# EAGLE design ChargerShieldExpLCD (EAGLE 6.5.0)
Dings

## Sheet 1 of 3: User Interface
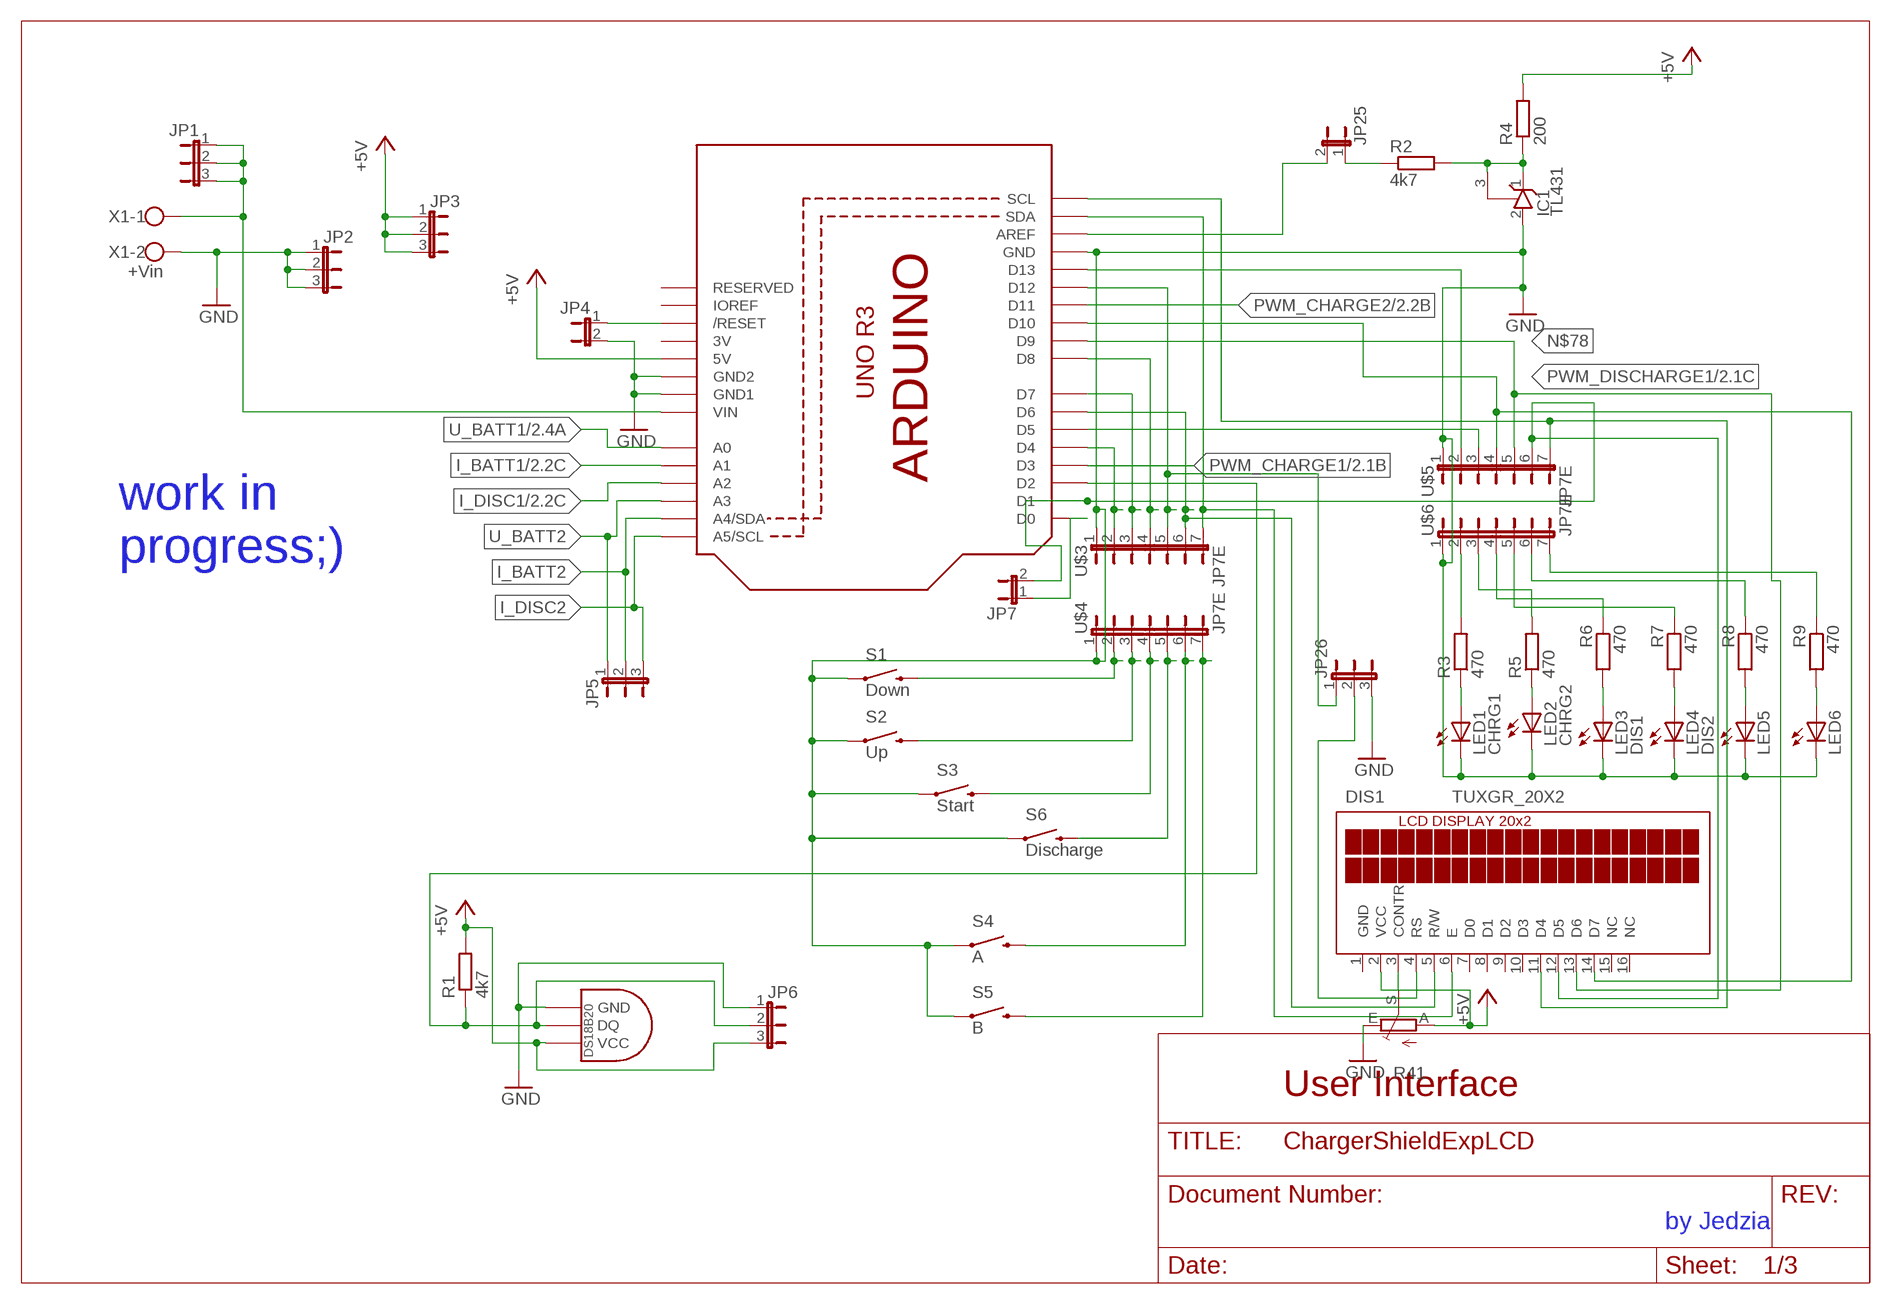
[diagram p0: schematic, sheet 1]

### Parts
DIS1  TUXGR_20X2  [TUXGR_20X2]
IC1  TL431  TL431TO92  [TO92]
JP1  JP2E  [JP2]
JP2  JP2E  [JP2]
JP3  JP2E  [JP2]
JP4  JP1E  [JP1]
JP5  JP2E  [JP2]
JP6  JP2E  [JP2]
JP7  JP1E  [JP1]
JP25  JP1E  [JP1]
JP26  JP2E  [JP2]
LED1  CHRG1  LED5MM_BIG  [LED5MM_BIG]
LED2  CHRG2  LED5MM_BIG  [LED5MM_BIG]
LED3  DIS1  LED5MM_BIG  [LED5MM_BIG]
LED4  DIS2  LED5MM_BIG  [LED5MM_BIG]
LED5  LED5MM_BIG  [LED5MM_BIG]
LED6  LED5MM_BIG  [LED5MM_BIG]
R1  4k7  R-EU_0204/7  [0204/7]
R2  4k7  R-EU_0207/10  [0207/10]
R3  470  R-EU_0207/12  [0207/12]
R4  200  R-EU_0204/7  [0204/7]
R5  470  R-EU_0207/10  [0207/10]
R6  470  R-EU_0207/10  [0207/10]
R7  470  R-EU_0207/10  [0207/10]
R8  470  R-EU_0204/7  [0204/7]
R9  470  R-EU_0204/7  [0204/7]
R41  TRIM_EU-B25P  [B25P]
S1  Down  SWITCH-MOMENTARY-2PTH_UMSE  [TACTILE-PTH-UMSE]
S2  Up  SWITCH-MOMENTARY-2PTH_UMSE  [TACTILE-PTH-UMSE]
S3  Start  SWITCH-MOMENTARY-2PTH_UMSE  [TACTILE-PTH-UMSE]
S4  A  SWITCH-MOMENTARY-2PTH_UMSE  [TACTILE-PTH-UMSE]
S5  B  SWITCH-MOMENTARY-2PTH_UMSE  [TACTILE-PTH-UMSE]
S6  Discharge  SWITCH-MOMENTARY-2PTH_UMSE  [TACTILE-PTH-UMSE]
U$1  DS1820TO92  [DS1820]
U$2  ARDUINOR3BPLACE-LONG  [ARDUINOR3-BPLACE-LONG]
U$3  JP7E  [JP7]
U$4  JP7E  [JP7]
U$5  JP7E  [JP7]
U$6  JP7E  [JP7]
X1  +Vin  W237-102  [W237-102]

### Nets
+5V: DIS1.2(VCC) JP3.1 JP3.2 JP3.3 JP6.3 R1.2 R4.2 R41.A U$1.VDD(VCC) U$2.5V ; also sheet 2,3
GND: IC1.2(A) JP2.1 JP2.2 JP2.3 JP4.2 JP6.1 JP26.3 LED1.K(C) LED2.K(C) LED3.K(C) LED4.K(C) LED5.K(C) LED6.K(C) R41.E S1.1 S2.1 S3.1 S4.1 S5.1 S6.1 U$1.GND U$2.GND U$2.GND1 U$2.GND2 U$3.1 U$4.1 U$5.1 U$6.1 X1.2 ; also sheet 2,3
I_BATT1: U$2.A1 ; also sheet 2
I_BATT2: JP5.2 U$2.A4(A4/SDA)
I_DISC1: U$2.A2 ; also sheet 2
I_DISC2: JP5.3 U$2.A5(A5/SCL)
N$1: U$2.D13 U$5.2
N$2: LED1.A R3.1
N$12: JP6.2 R1.1 U$1.DQ U$2.D2
N$19: R7.1 U$6.5
N$20: LED3.A R6.2
N$21: LED4.A R7.2
N$23: U$2.D5 U$5.3
N$24: LED2.A R5.1
N$26: S1.3 U$4.2
N$27: IC1.1(C) IC1.3(R) R2.2 R4.1
N$28: JP25.2 U$2.AREF
N$30: S2.3 U$4.3
N$31: S3.3 U$4.4
N$37: S4.3 U$4.6
N$38: S5.3 U$4.7
N$39: LED5.A R8.2
N$40: LED6.A R9.2
N$41: R5.2 U$6.3
N$42: R9.1 U$6.7
N$52: JP7.1 U$2.D0
N$53: JP4.1 U$2.RESET(/RESET)
N$57: DIS1.3(CONTR) R41.S
N$63: DIS1.4(RS) JP26.2
N$64: JP25.1 R2.1
N$67: JP26.1 U$2.D12 U$3.5
N$68: R6.1 U$6.4
N$69: DIS1.11(D4) U$2.SCL U$5.7
N$70: R3.2 U$6.2
N$71: DIS1.6(E) U$2.SDA U$3.7
N$73: S6.3 U$4.5
N$74: U$2.D8 U$3.4
N$75: U$2.D7 U$3.3
N$76: U$2.D4 U$3.2
N$77: DIS1.5(R/W) U$2.D6 U$3.6
N$78: DIS1.13(D6) U$2.D9 U$5.5
N$84: R8.1 U$6.6
PWM_CHARGE1: U$2.D3 ; also sheet 2
PWM_CHARGE2: U$2.D11 ; also sheet 2
PWM_DISCHARGE1: DIS1.14(D7) U$2.D10 U$5.4 ; also sheet 2
PWM_DISCHARGE2: DIS1.12(D5) JP7.2 U$2.D1 U$5.6
U_BATT1: U$2.A0 ; also sheet 2
U_BATT2: JP5.1 U$2.A3
VIN: JP1.1 JP1.2 JP1.3 U$2.VIN X1.1 ; also sheet 2
Unconnected: DIS1.7(D0) DIS1.8(D1) DIS1.9(D2) DIS1.10(D3) DIS1.15(NC) DIS1.16(NC) U$2.IOREF U$2.RESERVED

### Notes on the sheet
- work in
  progress;)
- User Interface
- by Jedzia

## Sheet 2 of 3
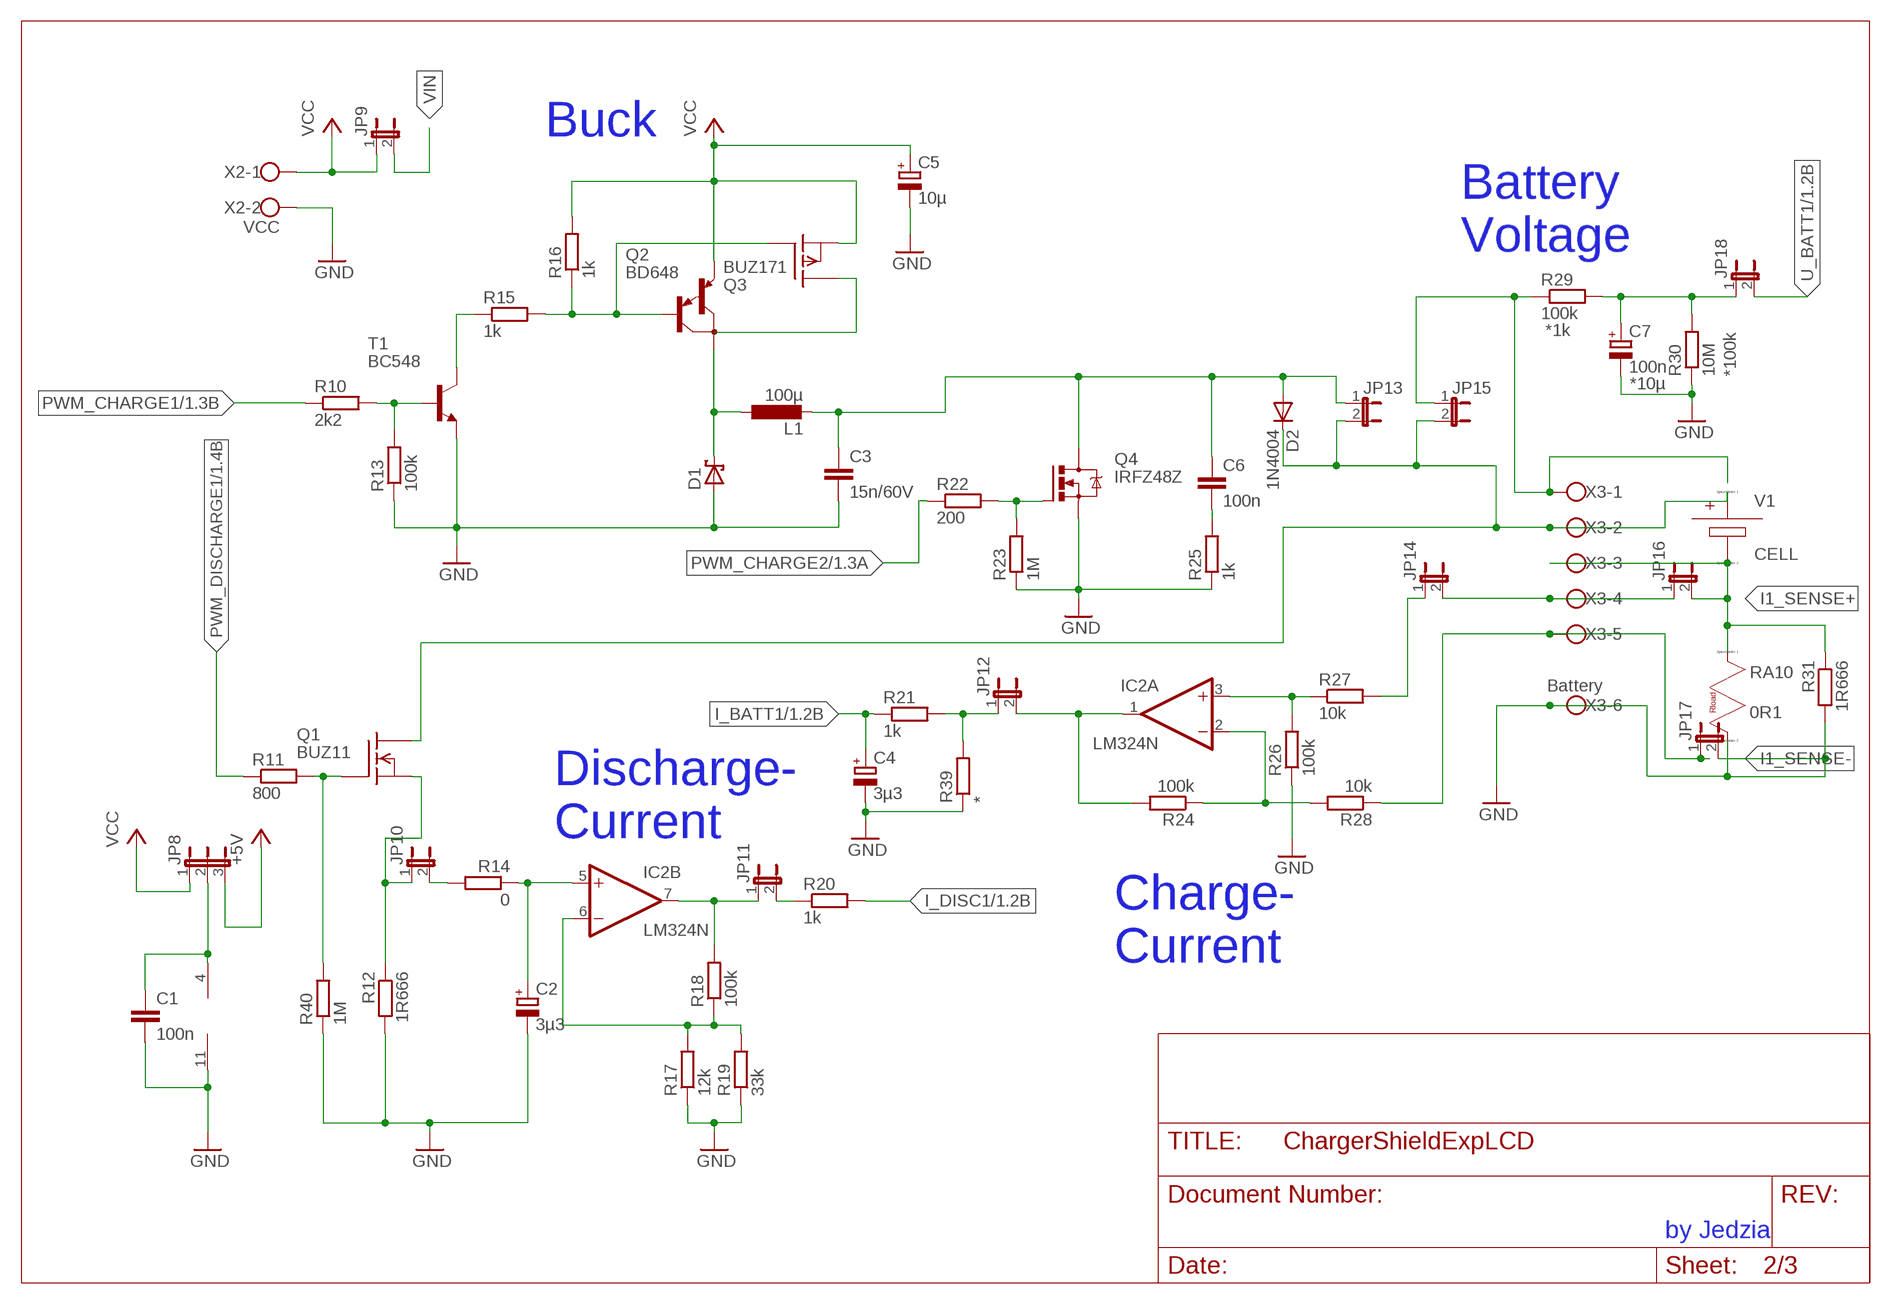
[diagram p1: schematic, sheet 2]

### Parts
C1  100n  C-EU025_050-025X075  [C025_050-025X075]
C2  3µ3  CPOL-EUE5-5  [E5-5]
C3  15n/60V  C-EU025_050-025X075  [C025_050-025X075]
C4  3µ3  CPOL-EUE5-5  [E5-5]
C5  10µ  CPOL-EUE5-5  [E5-5]
C6  100n  C-EU025_050-025X075  [C025_050-025X075]
C7  100n  CPOL-EUE5-5  [E5-5]
D1  SCHOTTKY-DIODEF126Z12  [F126Z12]
D2  1N4004  [DO41-10]
IC2  LM324N  [DIL14]
JP8  JP2E  [JP2]
JP9  JP1E  [JP1]
JP10  JP1E  [JP1]
JP11  JP1E  [JP1]
JP12  JP1E  [JP1]
JP13  JP1E  [JP1]
JP14  JP1E  [JP1]
JP15  JP1E  [JP1]
JP16  JP1E  [JP1]
JP17  JP1E  [JP1]
JP18  JP1E  [JP1]
L1  100µ  L-EU0207/12  [0207/12]
Q1  BUZ11  [TO220]
Q2  BD648  [TO220]
Q3  BUZ171  [TO220]
Q4  IRFZ48Z  [TO220BH]
R10  2k2  R-EU_0207/15  [0207/15]
R11  800  R-EU_0204/7  [0204/7]
R12  1R666  R-EU_0414/15  [0414/15]
R13  100k  R-EU_0207/10  [0207/10]
R14  0  R-EU_0207/10  [0207/10]
R15  1k  R-EU_0207/10  [0207/10]
R16  1k  R-EU_0207/10  [0207/10]
R17  12k  R-EU_0207/10  [0207/10]
R18  100k  R-EU_0207/10  [0207/10]
R19  33k  R-EU_0207/10  [0207/10]
R20  1k  R-EU_0207/15  [0207/15]
R21  1k  R-EU_0204/7  [0204/7]
R22  200  R-EU_0207/12  [0207/12]
R23  1M  R-EU_0207/10  [0207/10]
R24  100k  R-EU_0204/7  [0204/7]
R25  1k  R-EU_0207/10  [0207/10]
R26  100k  R-EU_0204/7  [0204/7]
R27  10k  R-EU_0207/10  [0207/10]
R28  10k  R-EU_0207/10  [0207/10]
R29  100k  R-EU_0207/12  [0207/12]
R30  10M  R-EU_0207/10  [0207/10]
R31  1R666  R-EU_0414/15  [0414/15]
R39  *  R-EU_0204/7  [0204/7]
R40  1M  R-EU_0207/10  [0207/10]
RA10  0R1  RES_RLOAD  (no package)
T1  BC548  BC238  [TO92]
V1  CELL  (no package)
X2  VCC  W237-102  [W237-102]
X3  Battery  W237-6  [W237-6]

### Nets
+5V: JP8.3 ; also sheet 1,3
GND: C1.2 C2.- C3.2 C4.- C5.- C7.- D1.A IC2.11(P:V-) JP17.2 Q4.S R12.2 R13.1 R17.1 R19.1 R23.1 R25.1 R26.1 R30.1 R31.2 R39.1 R40.1 RA10.B T1.1(E) X2.2 X3.6 ; also sheet 1,3
I1_SENSE+: JP16.2 R31.1 RA10.A V1.- X3.3
I1_SENSE-: JP17.1 R28.1 X3.5
I_BATT1: C4.+ R21.1 ; also sheet 1
I_DISC1: R20.2 ; also sheet 1
N$3: C7.+ JP18.1 R29.2 R30.2
N$4: C1.1 IC2.4(P:V+) JP8.2
N$5: R10.2 R13.2 T1.2(B)
N$6: R15.1 T1.3(C)
N$7: Q2.1(B) Q3.1(G) R15.2 R16.1
N$8: JP15.1 R29.1 X3.1
N$9: D1.C L1.1 Q2.2(C)
N$10: C3.1 C6.1 D2.A JP13.1 L1.2 Q4.D
N$11: IC2.1(A:OUT) JP12.2 R24.2
N$13: D2.C JP13.2 JP15.2 Q1.2(D) V1.+ X3.2
N$14: IC2.2(A:-IN) R24.1 R28.2
N$15: IC2.3(A:+IN) R26.2 R27.1
N$16: IC2.6(B:-IN) R17.2 R18.1 R19.2
N$17: IC2.7(B:OUT) JP11.1 R18.2
N$18: Q1.1(G) R11.2 R40.2
N$22: JP14.1 R27.2
N$25: JP10.1 Q1.3(S) R12.1
N$29: C2.+ IC2.5(B:+IN) R14.1
N$32: JP12.1 R21.2 R39.2
N$33: JP10.2 R14.2
N$35: JP11.2 R20.1
N$50: C6.2 R25.2
N$51: Q4.G R22.2 R23.2
N$54: JP14.2 JP16.1 X3.4
N$66: Q3.2(D)
PWM_CHARGE1: R10.1 ; also sheet 1
PWM_CHARGE2: R22.1 ; also sheet 1
PWM_DISCHARGE1: R11.1 ; also sheet 1
U_BATT1: JP18.2 ; also sheet 1
VCC: C5.+ JP8.1 JP9.1 Q2.3(E) Q3.3(S) R16.2 X2.1 ; also sheet 3
VIN: JP9.2 ; also sheet 1

### Notes on the sheet
- Buck
- Battery
  Voltage
- *1k
- *100k
- *10µ
- Discharge-
  Current
- Charge-
  Current
- by Jedzia

## Sheet 3 of 3
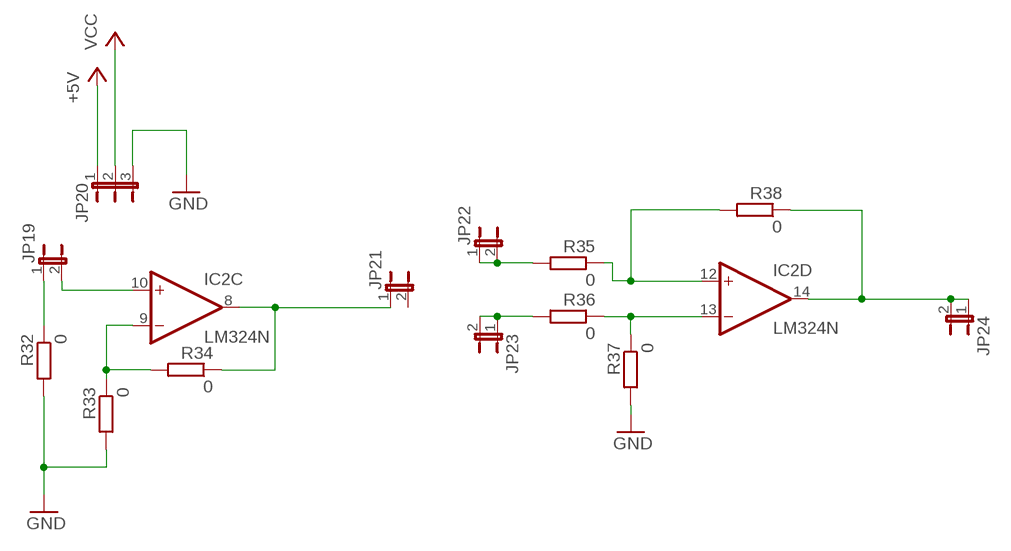
[diagram p2: schematic, sheet 3]

### Parts
JP19  JP1E  [JP1]
JP20  JP2E  [JP2]
JP21  JP1E  [JP1]
JP22  JP1E  [JP1]
JP23  JP1E  [JP1]
JP24  JP1E  [JP1]
R32  0  R-EU_0204/7  [0204/7]
R33  0  R-EU_0204/7  [0204/7]
R34  0  R-EU_0204/2V  [0204V]
R35  0  R-EU_0207/10  [0207/10]
R36  0  R-EU_0204/7  [0204/7]
R37  0  R-EU_0204/7  [0204/7]
R38  0  R-EU_0204/7  [0204/7]

### Nets
+5V: JP20.1 ; also sheet 1,2
GND: JP20.3 R32.2 R33.2 R37.2 ; also sheet 1,2
N$34: IC2.8(C:OUT) JP21.1 R34.1
N$36: IC2.13(D:-IN) R36.1 R37.1
N$43: IC2.10(C:+IN) JP19.2
N$44: JP19.1 R32.1
N$45: IC2.12(D:+IN) R35.1 R38.2
N$46: JP22.1 JP22.2 R35.2
N$47: JP23.1 JP23.2 R36.2
N$48: IC2.14(D:OUT) JP24.1 JP24.2 R38.1
N$49: IC2.9(C:-IN) R33.1 R34.2
VCC: JP20.2 ; also sheet 2
Unconnected: JP21.2

## Power pins joined to a net without a drawn wire
3V: U$2.3V
GND: DIS1.1(GND)

## Library data of the parts
C1 C3 C6 = rcl:C-EU: CAPACITOR, European symbol
C2 C4 C5 C7 = rcl:CPOL-EU: POLARIZED CAPACITOR, European symbol
D1 = diode:SCHOTTKY-DIODE: Schottky Diode
D2 = diode:1N4004: DIODE general purpose rectifier, 1 A
DIS1 = display-lcd:TUXGR_20X2: Tuxgraphics LCD display 20x2 characters reflective, without background light Source: tuxgr_20x2.pdf; OC_FARNELL: unknown; OC_NEWARK: unknown
IC1 = AWJLEagleLib:TL431: TL431 shunt regulator CARE: not a standard pinout. This part has 1: cathode, 2: REF, 3: anode
IC2 = linear:LM324: OP AMP
JP1-JP3 JP5 JP6 JP8 JP20 JP26 = bigger:JP2E: JUMPER
JP4 JP7 JP9-JP19 JP21-JP25 = bigger:JP1E: JUMPER
L1 = rcl:L-EU: INDUCTOR, European symbol
LED1-LED6 = bigger:LED: LED OSRAM: - CHIPLED LG R971, LG N971, LY N971, LG Q971, LY Q971, LO R971, LY R971 LH N974, LH R974 LS Q976, LO Q976, LY Q976 LO Q996 - Hyper CHIPLED LW Q18S LB Q993, LB Q99A, LB R99A - SideLED LS A670, LO A670, LY A670, LG A670, LP A670 LB A673, LV A673, LT A673, LW A673 LH A674 LY A675 LS A676, LA A676, LO A676, LY A676, LW A676 LS A679, LY A679, LG A679 - Hyper Micro SIDELED® LS Y876, LA Y876, LO Y876, LY Y876 LT Y87S - SmartLED LW L88C, LW L88S LB L89C, LB L89S, LG L890 LS L89K, LO L89K, LY L89K LS L896, LA L896, LO L896, LY L896 - TOPLED LS T670, LO T670, LY T670, LG T670, LP T670 LSG T670, LSP T670, LSY T670, LOP T670, LYG T670 LG T671, LOG T671, LSG T671 LB T673, LV T673, LT T673, LW T673 LH T674 LS T676, LA T676, LO T676, LY T676, LB T676, LH T676, LSB T676, LW T676 LB T67C, LV T67C, LT T67C, LS T67K, LO T67K, LY T67K, LW E67C LS E67B, LA E67B, LO E67B, LY E67B, LB E67C, LV E67C, LT E67C LW T67C LS T679, LY T679, LG T679 LS T770, LO T770, LY T770, LG T770, LP T770 LB T773, LV T773, LT T773, LW T773 LH T774 LS E675, LA E675, LY E675, LS T675 LS T776, LA T776, LO T776, LY T776, LB T776 LHGB T686 LT T68C, LB T68C - Hyper Mini TOPLED® LB M676 - Mini TOPLED Santana® LG M470 LS M47K, LO M47K, LY M47K Source: http://www.osram.convergy.de LUXEON: - LUMILED® LXK2-PW12-R00, LXK2-PW12-S00, LXK2-PW14-U00, LXK2-PW14-V00 LXK2-PM12-R00, LXK2-PM12-S00, LXK2-PM14-U00 LXK2-PE12-Q00, LXK2-PE12-R00, LXK2-PE12-S00, LXK2-PE14-T00, LXK2-PE14-U00 LXK2-PB12-K00, LXK2-PB12-L00, LXK2-PB12-M00, LXK2-PB14-N00, LXK2-PB14-P00, LXK2-PB14-Q00 LXK2-PR12-L00, LXK2-PR12-M00, LXK2-PR14-Q00, LXK2-PR14-R00 LXK2-PD12-Q00, LXK2-PD12-R00, LXK2-PD12-S00 LXK2-PH12-R00, LXK2-PH12-S00 LXK2-PL12-P00, LXK2-PL12-Q00, LXK2-PL12-R00 Source: www.luxeon.com KINGBRIGHT: KA-3528ASYC Source: www.kingbright.com
Q1 = transistor-fet:BUZ11: N-Channel Enhancement MOSFET 50V; 30A; 0,040Ohm
Q2 = transistor-pnp:BD648: PNP Darlington Transistor
Q3 = transistor-fet:BUZ171: P-Channel Enhancement MOSFET -50V; 7A; 0,4Ohm
Q4 = transistor-power:IRFZ48: N Channel HEXFET® Power MOSFET Logic Level Source: http://www.irf.com/product-info/datasheets/data/irfz48z.pdf
R1-R40 = rcl:R-EU_: RESISTOR, European symbol
R41 = pot:TRIM_EU-: POTENTIOMETER
RA10 = lt-spice-simulation:RES_RLOAD: A resistor
S1-S6 = bigger:SWITCH-MOMENTARY-2: Various NO switches- pushbuttons, reed, etc
T1 = transistor:BC238: NPN TRANSISTOR
U$1 = Ava:DS1820: DS18B20 Programmable Resolution 1-Wire Digital Thermometer Description The DS18B20 digital thermometer provides 9-bit to 12-bit Celsius temperature measurements and has an alarm function with nonvolatile user-programmable upper and lower trigger points. The DS18B20 communicates over a 1-Wire® bus that by definition requires only one data line (and ground) for communication with a central microprocessor. It has an operating temperature range of -55°C to +125°C and is accurate to ±0.5°C over the range of -10°C to +85°C. In addition, the DS18B20 can derive power directly from the data line ("parasite power"), eliminating the need for an external power supply. Each DS18B20 has a unique 64-bit serial code, which allows multiple DS18B20s to function on the same 1-Wire bus. Thus, it is simple to use one microprocessor to control many DS18B20s distributed over a large area. Applications that can benefit from this feature include HVAC environmental controls, temperature monitoring systems inside buildings, equipment, or machinery, and process monitoring and control systems.
U$2 = arduino-long:ARDUINOR3: This is a new object for the new Arduino R3 - with extra pins that you may want to use (such as IOref, and duplicated A4/A5
U$3-U$6 = bigger:JP7E
V1 = Misc:CELL: Voltage Source, either DC, AC, PULSE, SINE, PWL, EXP, or SFFM
X1 X2 = con-wago-500:W237-102: WAGO SCREW CLAMP; MPN: 237-102; OC_FARNELL: unknown; OC_NEWARK: 70K9898
X3 = con-wago-500:W237-6: WAGO SCREW CLAMP; OC_FARNELL: unknown; OC_NEWARK: unknown

## Board
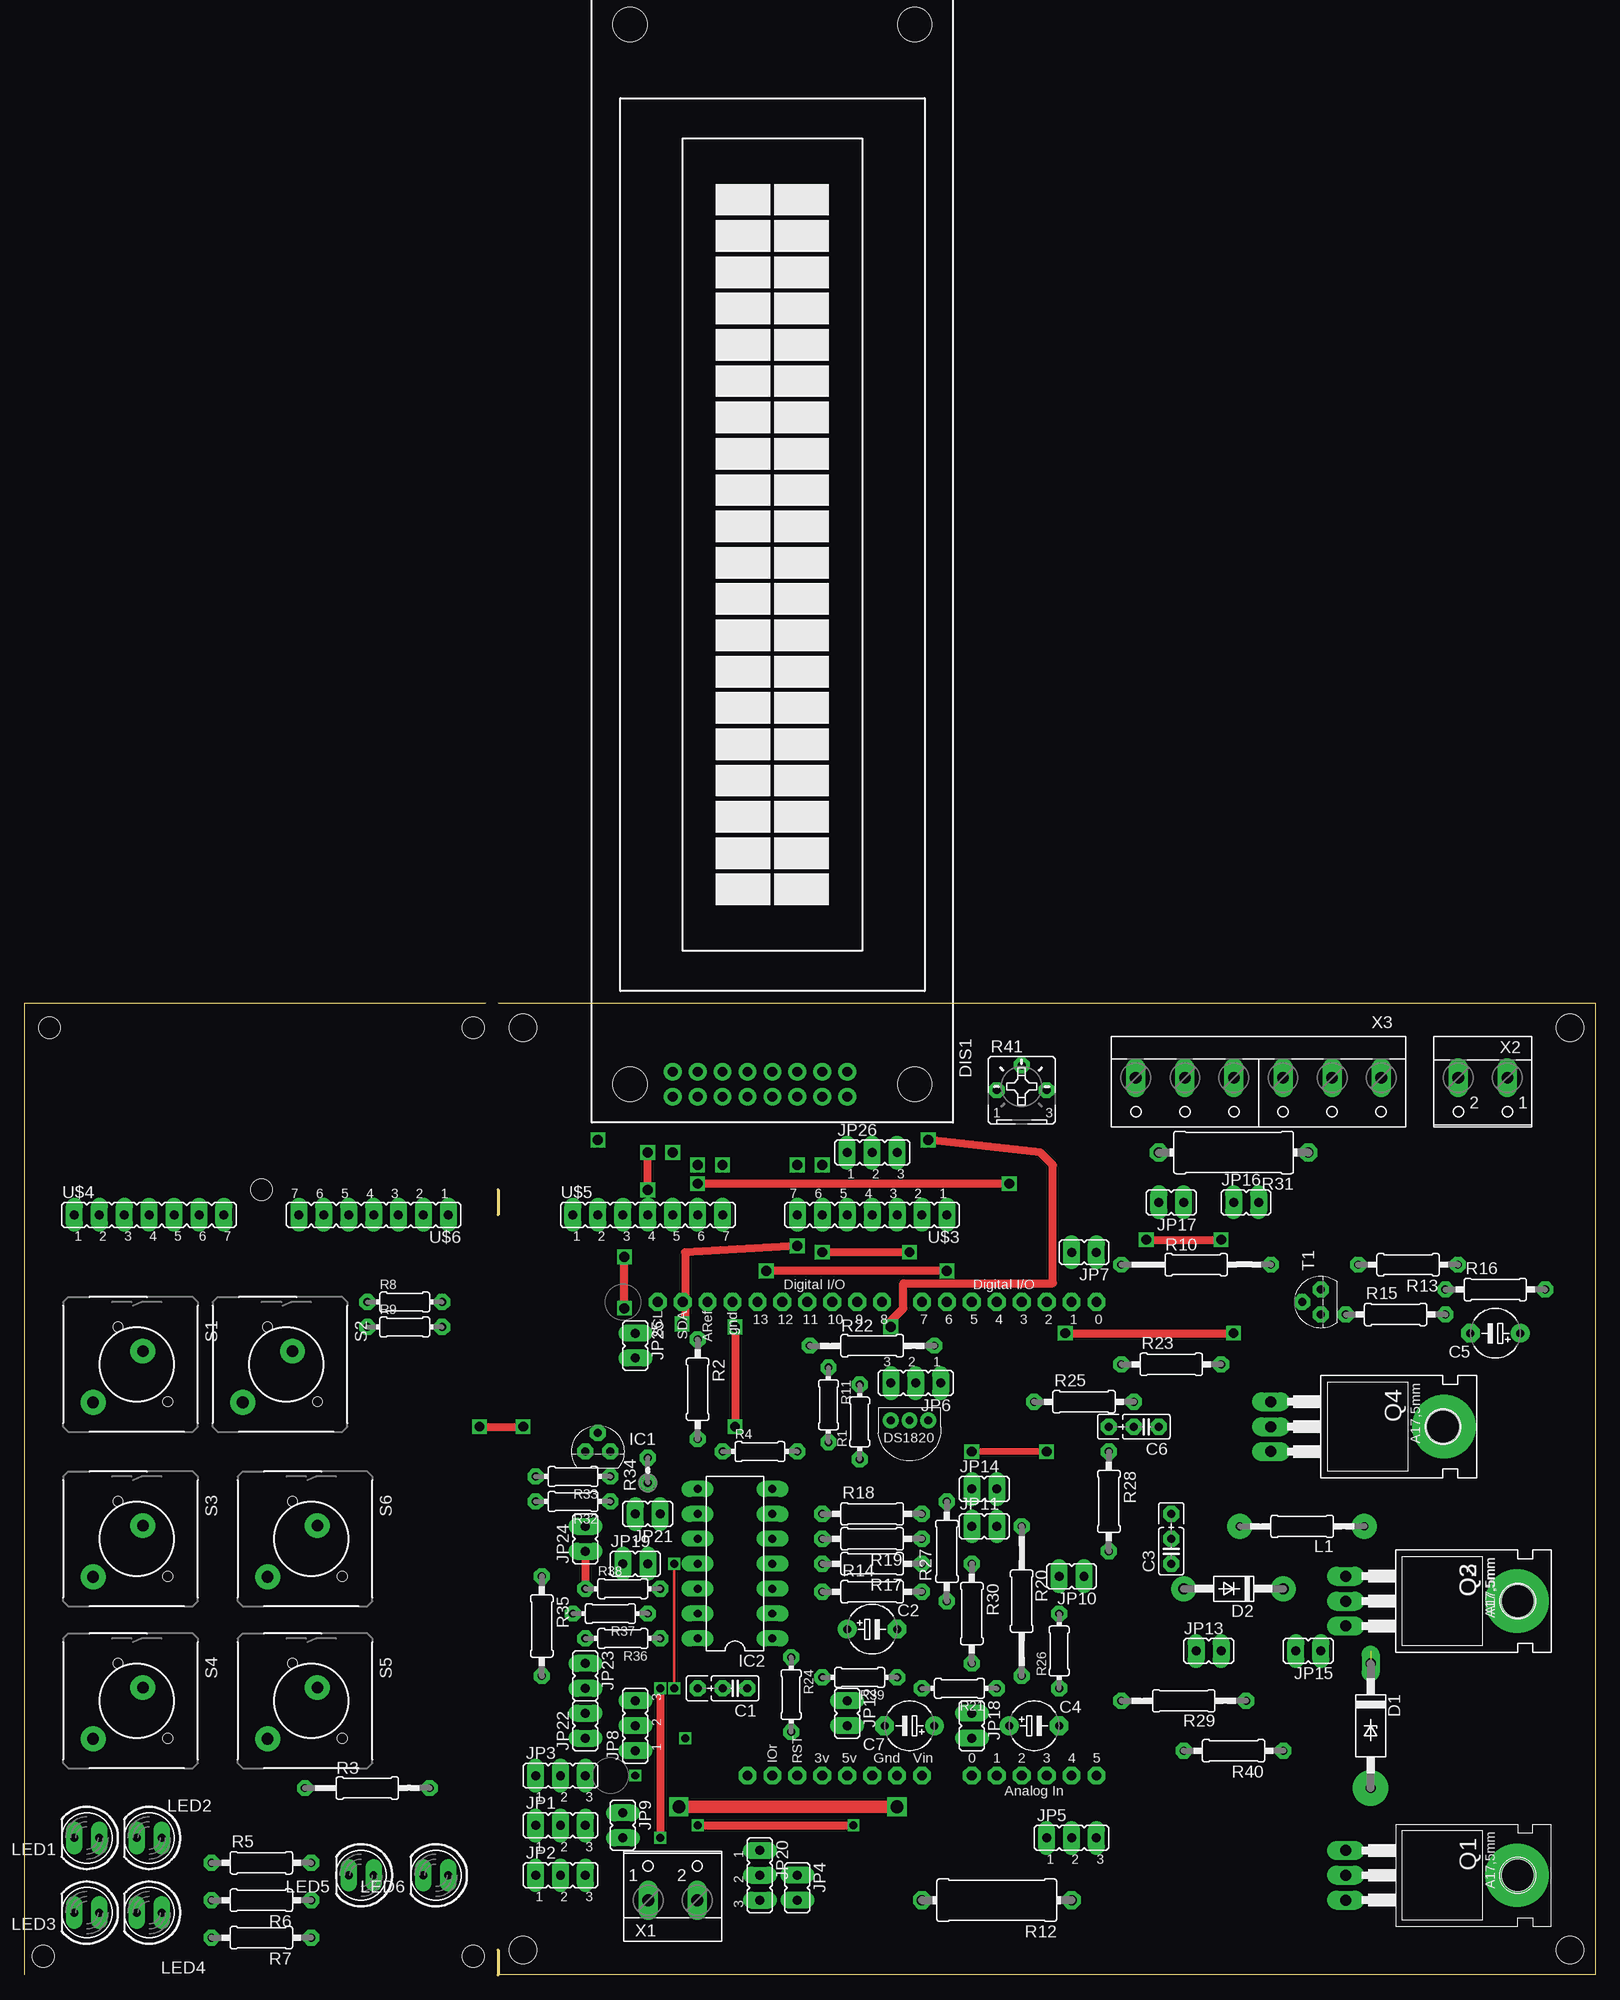
[diagram p3: board, top side]
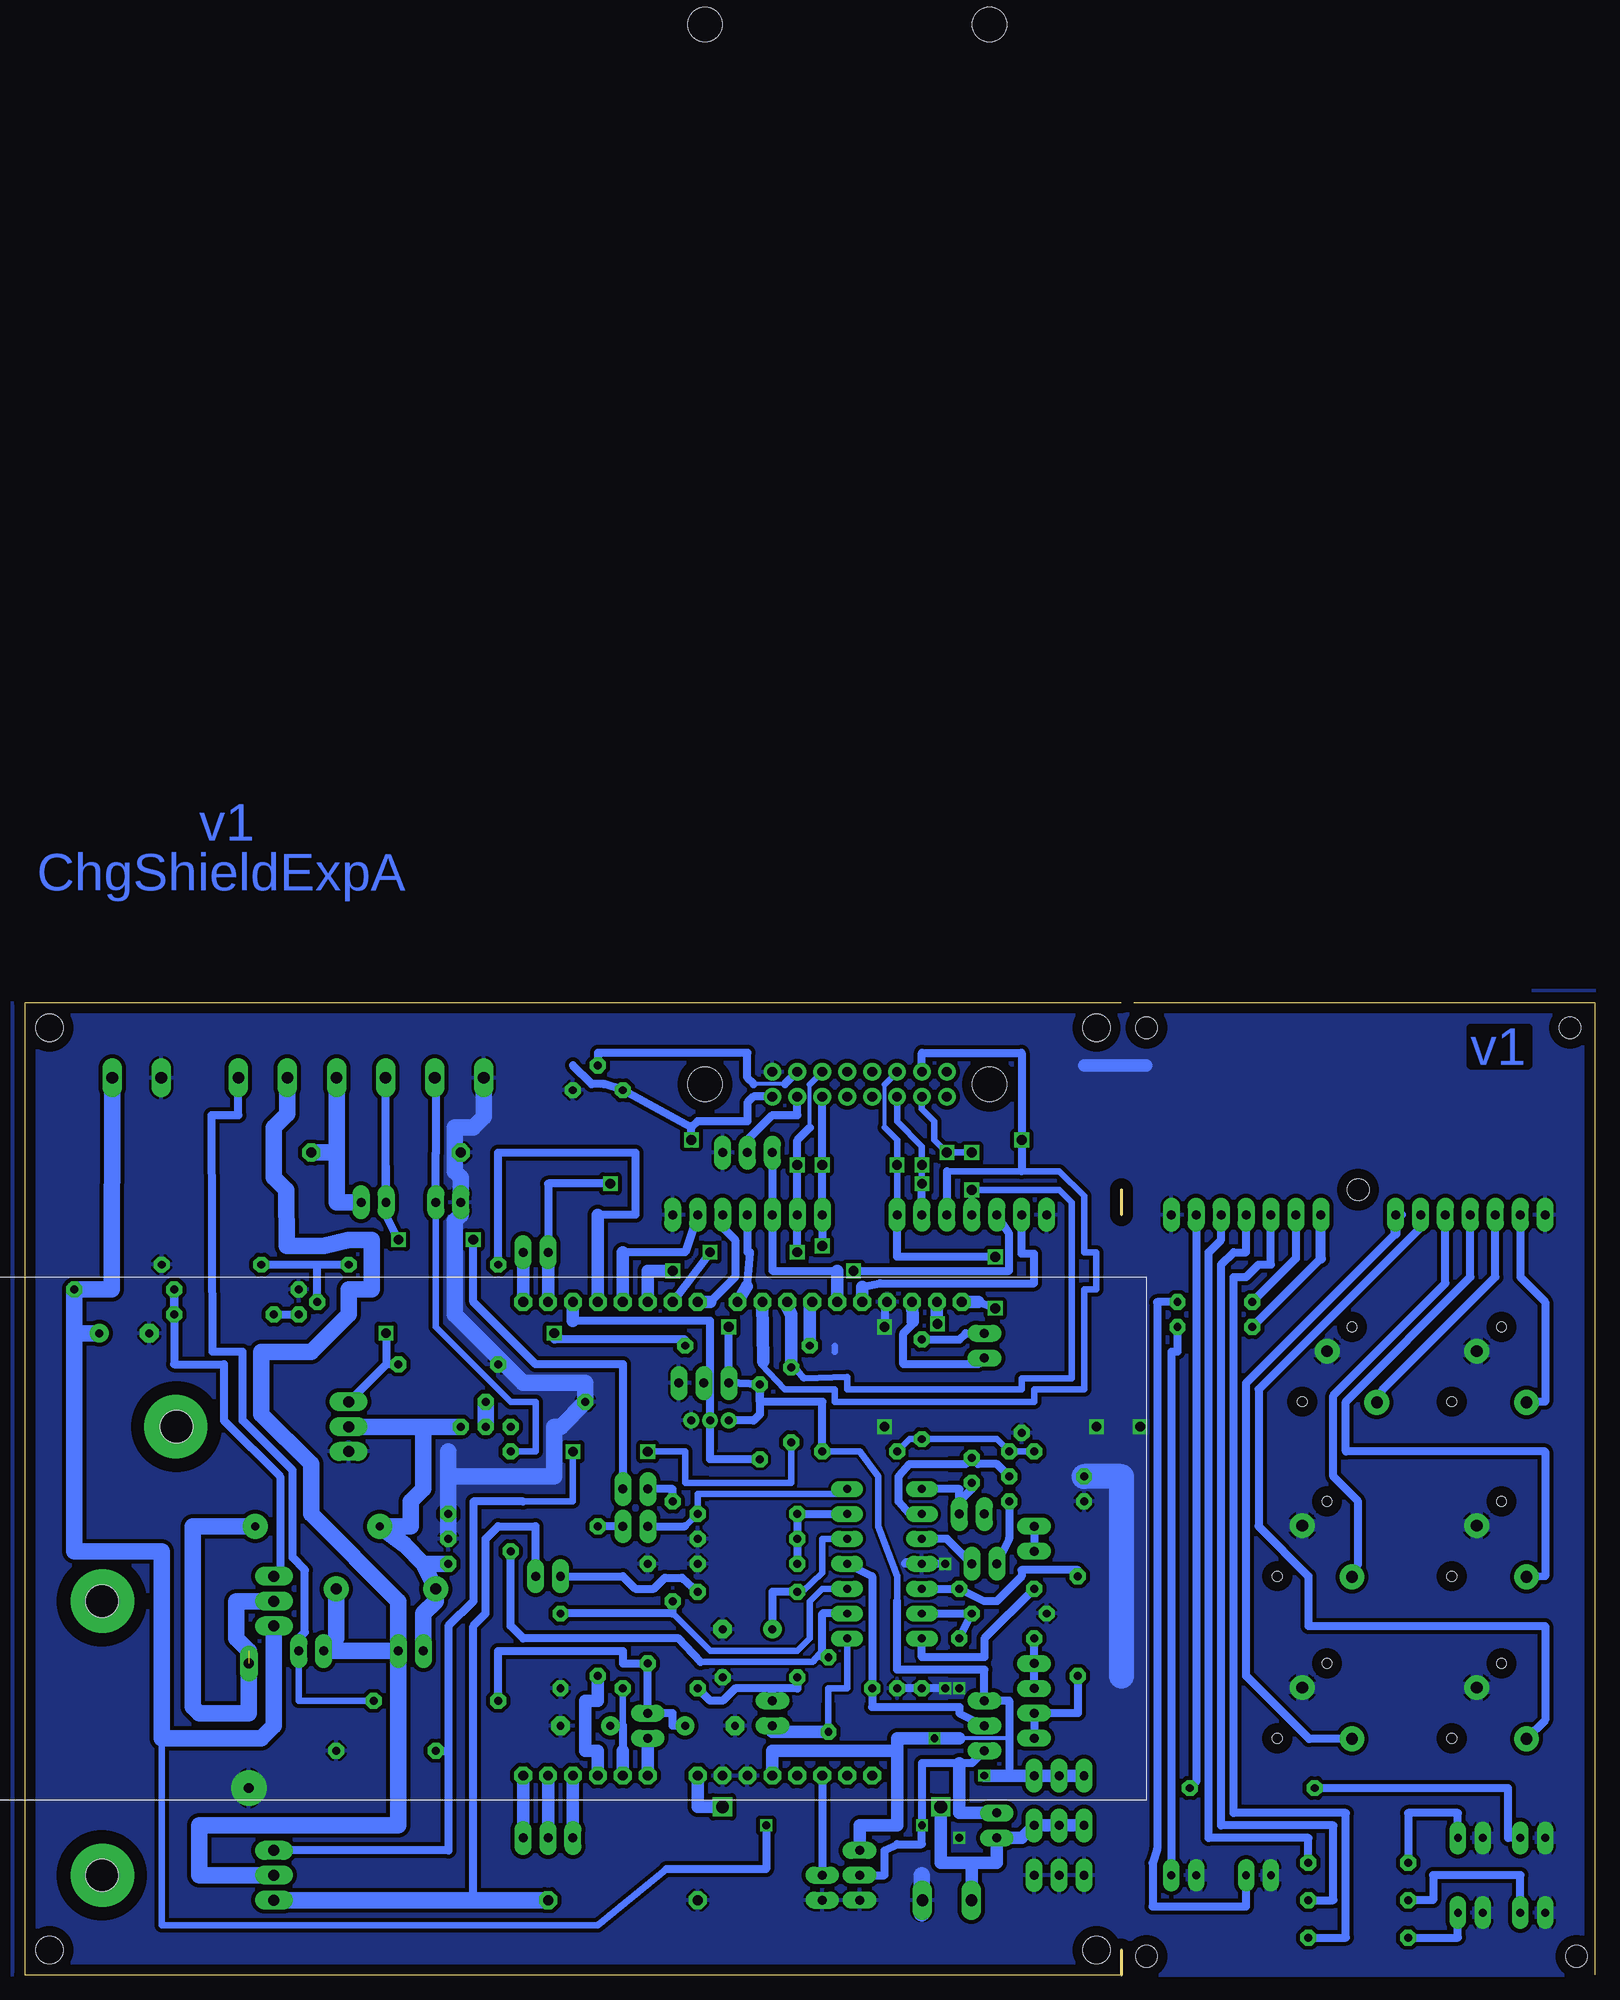
[diagram p4: board, bottom side, seen from below]

Size 160.02 x 99.06 mm. Coordinates in mm from the lower left corner, seen from the top.
Outline: 48.26,99.06 160.02,99.06 160.02,0 48.26,0 48.26,2.54
Outline: 0,0 0,99.06 46.99,99.06
Outline: 48.26,80.01 48.26,77.47
Copper layers (1*16): Top 0.035mm / dielectric 1.5mm / Bottom 0.035mm
Design rules "charger": minimum track width 26mil, minimum drill 24mil, track to track 12mil, track to pad 12mil, pad to pad 10mil, via to via 12mil, smd to smd 10mil, copper to edge 40mil, drill to drill 10mil, minimum pad ring 16mil, minimum via ring 8mil, stop-mask expansion 4mil, vias tented up to drill 0mil, thermal gap 10mil
Holes 2.8 mm at 50.8,2.54 50.8,96.52 157.48,2.54 157.48,96.52
Holes 2.2 mm at 2.54,96.52 45.72,96.52 1.91,1.91 45.72,1.91 24.13,80.01

### Footprints (pad centres in the part's own frame; a part is rotated, then mirrored left to right if it is on the bottom)
C025_050-025X075 = drill 0.813 octagon: 1 -1.27,0; 2 1.27,0; 3 3.81,0
E5-5 = drill 0.813 pad 1.905: + -2.54,0 | drill 0.813 pad 1.905 octagon: - 2.54,0
F126Z12 = drill 1.016 long: A 6.35,0; C -6.35,0
DO41-10 = drill 1.118: A 5.08,0; C -5.08,0
TUXGR_20X2 = drill 1 pad 1.676: 1 -52.73,-7.62; 2 -55.27,-7.62; 3 -52.73,-5.08; 4 -55.27,-5.08; 5 -52.73,-2.54; 6 -55.27,-2.54; 7 -52.73,0; 8 -55.27,0; 9 -52.73,2.54; 10 -55.27,2.54; 11 -52.73,5.08; 12 -55.27,5.08; 13 -52.73,7.62; 14 -55.27,7.62; 15 -52.73,10.16; 16 -55.27,10.16 | hole 3.5: -54,-14.5; 54,-14.5; -54,14.5; 54,14.5
TO92 = drill 0.813 octagon: 1 1.27,-1.27; 2 0,0.635; 3 -1.27,-1.27
DIL14 = drill 0.813 long: 1 -7.62,-3.81; 2 -5.08,-3.81; 3 -2.54,-3.81; 4 0,-3.81; 5 2.54,-3.81; 6 5.08,-3.81; 7 7.62,-3.81; 8 7.62,3.81; 9 5.08,3.81; 10 2.54,3.81; 11 0,3.81; 12 -2.54,3.81; 13 -5.08,3.81; 14 -7.62,3.81
JP2 = drill 0.914 long: 1 -2.54,0; 2 0,0; 3 2.54,0
JP1 = drill 0.914 long: 1 0,-1.27; 2 0,1.27
0207/12 = drill 0.813 octagon: 1 -6.35,0; 2 6.35,0
LED5MM_BIG = drill 0.8 pad 1.676 long: A -1.27,0; K 1.27,0
TO220 = drill 1.118 long: 1 -2.54,-6.35; 2 0,-6.35; 3 2.54,-6.35 | hole 3.302: 0,11.176
TO220BH = drill 1.118 long: D 0,-6.35; G -2.54,-6.35; S 2.54,-6.35 | hole 3.302: 0,11.176
0204/7 = drill 0.813 octagon: 1 -3.81,0; 2 3.81,0
0207/10 = drill 0.813 octagon: 1 -5.08,0; 2 5.08,0
0207/15 = drill 0.813 octagon: 1 -7.62,0; 2 7.62,0
0414/15 = drill 1.016 octagon: 1 -7.62,0; 2 7.62,0
0204V = drill 0.813 octagon: 1 -1.27,0; 2 1.27,0
B25P = drill 0.813 octagon: A -2.54,0; E 2.54,0; S 0,2.54
TACTILE-PTH-UMSE = drill 1.2 pad 2.54: 1 -1.346,0.635; 3 3.886,-4.445 | hole 1: 3.81,3.175; -3.81,-1.905
TO92' = drill 0.813 octagon: 1 1.27,0; 2 0,1.905; 3 -1.27,0
DS1820 = drill 0.8: DQ 2.54,-1.27; GND 0.635,-1.27; VDD 4.445,-1.27
ARDUINOR3-BPLACE-LONG = drill 1 pad 1.676 octagon: 3V 35.56,2.54; 5V 38.1,2.54; A0 50.8,2.54; A1 53.34,2.54; A2 55.88,2.54; A3 58.42,2.54; A4 60.96,2.54; A5 63.5,2.54; AREF 23.876,50.8; D0 63.5,50.8; D1 60.96,50.8; D2 58.42,50.8; D3 55.88,50.8; D4 53.34,50.8; D5 50.8,50.8; D6 48.26,50.8; D7 45.72,50.8; D8 41.656,50.8; D9 39.116,50.8; D10 36.576,50.8; D11 34.036,50.8; D12 31.496,50.8; D13 28.956,50.8; GND 26.416,50.8; GND1 43.18,2.54; GND2 40.64,2.54; IOREF 30.48,2.54; RESERVED 27.94,2.54; RESET 33.02,2.54; SCL 18.796,50.8; SDA 21.336,50.8; VIN 45.72,2.54
JP7 = drill 0.914 long: 1 -7.62,0; 2 -5.08,0; 3 -2.54,0; 4 0,0; 5 2.54,0; 6 5.08,0; 7 7.62,0
W237-102 = drill 1.194 long: 1 -2.5,-1.27; 2 2.5,-1.27
W237-6 = drill 1.194 long: 1 -12.5,-1.27; 2 -7.5,-1.27; 3 -2.5,-1.27; 4 2.5,-1.27; 5 7.5,-1.27; 6 12.5,-1.27

### Placement (x,y rotation side)
C1  72.39,29.21 180 top
C2  86.36,35.24 0 top
C3  116.84,43.18 90 top
C4  102.87,25.4 0 top
C5  149.86,65.41 180 top
C6  114.3,55.88 180 top
C7  90.17,25.4 180 top
D1  137.16,25.4 270 top
D2  123.19,39.37 180 top
DIS1  76.2,144.78 90 top
IC1  58.42,54.61 0 top
IC2  72.39,41.91 90 top
JP1  54.61,15.24 0 top
JP2  54.61,10.16 0 top
JP3  54.61,20.32 0 top
JP4  78.74,8.89 180 top
JP5  106.68,13.97 0 top
JP6  90.81,60.33 180 top
JP7  107.95,73.66 90 top
JP8  62.23,25.4 90 top
JP9  60.96,15.24 180 top
JP10  106.68,40.64 90 top
JP11  97.79,45.72 270 top
JP12  83.82,26.67 180 top
JP13  120.65,33.02 270 top
JP14  97.79,49.53 270 top
JP15  130.81,33.02 90 top
JP16  124.46,78.74 270 top
JP17  116.84,78.74 90 top
JP18  96.52,25.4 180 top
JP19  62.23,41.91 270 top
JP20  74.93,10.16 270 top
JP21  63.5,46.99 90 top
JP22  57.15,25.4 0 top
JP23  57.15,30.48 180 top
JP24  57.15,44.45 0 top
JP25  62.23,64.13 180 top
JP26  86.36,83.82 0 top
L1  130.18,45.72 180 top
LED1  6.35,13.97 180 top
LED2  12.7,13.97 180 top
LED3  6.35,6.35 180 top
LED4  12.7,6.35 180 top
LED5  34.29,10.16 180 top
LED6  41.91,10.16 180 top
Q1  140.97,10.16 270 top
Q2  140.97,38.1 270 top
Q3  140.97,38.1 270 top
Q4  133.35,55.88 270 top
R1  85.09,56.36 90 top
R2  68.58,59.69 270 top
R3  34.92,19.05 0 top
R4  74.93,53.34 0 top
R5  24.13,11.43 0 top
R6  24.13,7.62 180 top
R7  24.13,3.81 180 top
R8  38.73,68.58 0 top
R9  38.73,66.04 0 top
R10  119.38,72.39 0 top
R11  81.91,58.1 270 top
R12  99.06,7.62 180 top
R13  140.97,72.39 180 top
R14  86.36,39.05 0 top
R15  139.7,67.31 0 top
R16  149.86,69.85 0 top
R17  86.36,41.91 180 top
R18  86.36,46.99 0 top
R19  86.36,44.45 180 top
R20  101.6,38.1 270 top
R21  95.25,29.21 180 top
R22  86.36,64.13 0 top
R23  116.84,62.23 0 top
R24  78.1,28.58 270 top
R25  107.95,58.42 0 top
R26  105.41,33.02 90 top
R27  93.98,43.18 90 top
R28  110.49,48.26 270 top
R29  118.11,27.94 180 top
R30  96.52,36.83 270 top
R31  123.19,83.82 180 top
R32  55.88,48.26 180 top
R33  55.88,50.8 180 top
R34  63.5,51.44 90 top
R35  52.7,35.56 270 top
R36  60.96,34.29 180 top
R37  59.69,36.83 180 top
R38  60.96,39.37 0 top
R39  85.09,30.32 180 top
R40  123.19,22.86 180 top
R41  101.6,90.17 0 top
S1  11.43,62.23 270 top
S2  26.67,62.23 270 top
S3  11.43,44.45 270 top
S4  11.43,27.94 270 top
S5  29.21,27.94 270 top
S6  29.21,44.45 270 top
T1  BC548  [TO92']  132.08,68.58 90 top
U$1  92.71,55.25 180 top
U$2  45.72,17.78 0 top
U$3  86.36,77.47 180 top
U$4  12.7,77.47 0 top
U$5  63.5,77.47 0 top
U$6  35.56,77.47 180 top
X1  66.04,8.89 0 top
X2  148.59,90.17 180 top
X3  125.73,90.17 180 top

### Tracks (layer width: path | path; a pad name or v marks a point on that pad's centre or on a via)
+5V  (via drill 0.8, 1)
  Top 0.813: v88.27,66.04 88.27,66.68 89.53,67.94 89.53,70.48 104.78,70.48 104.78,82.55 103.5,83.82 v92.07,85.09
  Bottom 0.406: 59.69,24.13 64.77,24.13
  Bottom 0.66: R4.2 74.93,53.34 73.03,50.8 73.03,45.72 71.12,40.64 71.12,38.1
  Bottom 0.813: 71.12,38.1 71.12,31.12 62.23,31.12 JP8.3 59.69,27.94 59.69,24.13 59.69,20.32 | R4.2 78.74,58.42 85.09,58.42 R1.2 | R1.2 85.09,57.15 85.72,56.52 U$1.VDD | R1.2 JP6.3 v88.27,66.04 | DIS1.2 85.75,89.51 86.36,88.9 86.36,87 91.44,87 92.07,86.36 | 92.07,86.36 R41.A 100.97,90.81 102.23,90.81 104.14,92.71 | v92.07,85.09 92.07,86.36
  Bottom 1.27: 71.12,22.86 83.82,22.86 U$2.5V | 71.12,22.86 71.12,24.13 v67.31,24.13 64.77,24.13 | v62.23,20.32 59.69,20.32 JP3.3 JP3.2 JP3.1 | JP20.1 74.93,15.24 71.12,15.24 71.12,22.86
GND  (via drill 0.8, 0.8 pad 3.61, 1)
  Top 0.259: v66.2,29.21 v66.2,41.91
  Top 0.813: v72.39,66.04 v72.39,55.88 | v64.77,29.21 v64.77,13.97 | v46.35,55.88 v50.8,55.88
  Bottom 0.66: 77.47,63.5 77.47,64.11
  Bottom 0.813: U$2.GND 72.39,68.58 v72.39,66.04 | v66.2,29.21 C1.2 | 66.04,41.91 IC2.11 69.85,41.91 | 69.85,41.91 70.33,41.91 70.17,42.07 69.85,41.91
  Bottom 1.27: 45.72,92.71 52.07,92.71
  Bottom 1.676: 68.58,10.16 68.58,6.31 X1.2 | 116.84,53.34 116.84,50.8 | 116.84,50.8 C3.2 | 116.84,50.8 106.05,50.8 106.05,55.88 105.41,55.88 R25.1 102.87,60.33 109.22,60.33 116.2,67.31 116.2,76.84 115.57,77.47 115.57,81.28 116.2,81.92 116.2,86.36 114.3,86.36 113.23,87.43 X3.6
  Bottom 2.54: 48.26,30.48 48.26,50.8 R33.2
  other vias: 137.16,19.05
  pour Bottom (isolate 0.406, rank 2): 0,0 0,100.33 161.29,99.06 161.29,0
  pour Bottom (isolate 0.305, rank 3): 66.04,53.34 90.17,53.34 90.17,27.94 66.04,27.94
  pour Bottom (isolate 0.61): 45.72,2.54 45.72,53.34 33.02,53.34 33.02,71.12 3.81,71.12 2.54,2.54
I1_SENSE+
  Bottom 1.676: R31.1 128.23,83.82 | 128.23,83.82 128.23,78.74 JP16.2 | 128.23,83.82 X3.3
I1_SENSE-
  Bottom 0.66: R28.1 107.95,53.34 107.95,58.42 110.49,58.42 118.11,66.04 JP17.1 | 118.11,91.44 X3.5
  Bottom 0.813: 118.11,91.44 118.11,83.82 JP17.1
I_BATT1
  Bottom 0.66: 99.06,22.86 R21.1
  Bottom 0.813: C4.+ 99.06,25.4 99.06,22.86
  Bottom 1.27: U$2.A1 99.06,22.86
I_BATT2
  Bottom 1.27: U$2.A4 JP5.2
I_DISC1
  Bottom 1.27: R20.2 101.6,27.94 102.87,27.94 102.87,22.86 101.6,22.86 U$2.A2
I_DISC2
  Bottom 1.27: U$2.A5 JP5.3
N$1
  Bottom 0.813: 74.68,70.1 72.87,70.48 57.15,70.48 57.15,73.5 58.42,73.5 U$5.2
  Bottom 1.27: U$2.D13 74.68,70.1
N$2
  Bottom 0.813: LED1.A 8.89,13.97 8.89,19.05 R3.1
N$3
  Bottom 0.813: C7.+ 93.98,25.4 93.98,26.67 JP18.1 R30.2 99.06,31.75 99.06,33.02 111.76,33.02 R29.2
N$4
  Bottom 0.813: IC2.4 73.66,40.64 C1.1 73.66,27.3 64.77,27.3 64.77,26.67 JP8.2
N$5
  Bottom 0.813: R13.2 130.18,72.39 | T1.2 130.18,72.39 | 130.18,72.39 R10.2
N$6
  Bottom 0.813: R15.1 T1.3
N$7
  Bottom 0.813: Q3.1 133.99,40.64 133.99,50.8 139.7,56.52 139.7,62.23 144.78,62.23 R16.1 R15.2
N$8
  Bottom 0.66: JP15.1 132.08,27.94 R29.1 | 138.43,91.44 X3.1
  Bottom 0.813: JP15.1 132.08,34.29 131.44,34.92 131.44,41.28 132.72,42.55 132.72,51.44 137.8,56.52 137.8,63.5 140.85,63.5 140.97,87.63 138.23,87.63 X3.1
N$9  (1 unrouted)
  Bottom 1.676: Q2.2 138.43,38.1 138.43,34.29 137.16,33.02 137.16,26.67 142.24,26.67 142.88,27.3 142.88,45.72 L1.1
N$10
  Bottom 1.676: C3.1 119.38,41.91 | JP13.1 119.38,36.83 118.11,38.1 D2.A 119.38,41.91 | 119.38,41.91 121.28,43.81 L1.2 120.65,45.72 120.65,48.26 119.38,49.53 119.38,55.88 Q4.D C6.1
N$11
  Bottom 0.66: 76.83,34.29 IC2.1 76.2,29.21 78.1,29.21 R24.2
  Bottom 0.813: 83.82,24.77 JP12.2
  Bottom 1.27: R24.2 83.82,24.77
N$12
  Bottom 0.813: R1.1 90.17,52.55 U$1.DQ 90.17,59.69 | 90.17,59.69 90.17,66.68 104.14,66.68 | JP6.2 90.17,59.69
  Bottom 1.27: 104.14,66.68 U$2.D2
N$13
  Bottom 1.676: JP13.2 JP15.2 128.27,34.29 D2.C | JP13.2 121.92,38.1 130.81,46.99 130.81,52.07 135.89,57.15 135.89,63.5 130.81,63.5 127,67.31 127,69.85 124.62,69.85 124.62,74.93 127,74.93 129.54,74.3 133.31,74.3 133.35,80.01 134.62,81.28 134.62,86.36 133.23,87.75 X3.2 | JP13.2 121.92,15.24 142.24,15.24 142.24,10.16 Q1.2
N$14
  Bottom 0.66: 77.47,36.83 IC2.2 | 91.12,31.91 79.69,31.91 78.74,33.02
  Bottom 0.813: 77.47,36.83 78.74,36.83 78.74,33.02 78.74,32.39 R24.1 | 91.12,31.91 93.34,34.29 109.22,34.29 110.49,35.56 R28.2
N$15
  Bottom 0.66: IC2.3 78.74,39.37 80.01,38.1 80.01,34.29 81.28,33.02 90.17,33.02 93.98,36.83
  Bottom 0.813: R27.1 93.98,36.83 R26.2
N$16
  Bottom 0.813: R17.2 R19.2 R18.1 IC2.6
N$17
  Bottom 0.66: 92.71,45.72 R18.2 91.44,49.05 76.83,49.05 IC2.7
  Bottom 0.813: JP11.1 92.71,45.72
N$18  (via drill 1)
  Top 0.66: v96.52,53.34 v104.14,53.34
  Bottom 0.66: 109.22,48.26 104.14,48.26 v104.14,53.34 | R11.2 81.91,50.16 92.71,50.16 92.71,53.34 v96.52,53.34
  Bottom 0.813: 109.22,48.26 114.3,48.26 114.3,38.1 116.84,35.56 116.84,22.86 | 116.84,22.86 116.84,12.7 Q1.1 | R40.2 116.84,22.86
N$19
  Bottom 0.813: R7.1 25.4,3.81 25.4,16.51 36.83,16.51 36.83,71.12 35.56,71.12 34.29,72.39 33.02,72.39 U$6.5
N$20
  Bottom 0.813: LED3.A 7.62,10.16 16.51,10.16 16.51,7.62 R6.2
N$21
  Bottom 0.813: R7.2 13.97,3.81 LED4.A
N$22
  Bottom 0.813: R27.2 93.98,49.53 JP14.1
N$23  (via drill 1)
  Top 0.813: v93.98,71.75 v75.56,71.75
  Bottom 0.813: U$5.3 59.69,75.56 59.69,71.75 v75.56,71.75
  Bottom 1.27: U$2.D5 96.52,71.75 v93.98,71.75
N$24
  Bottom 0.813: LED2.A 13.97,16.51 19.05,16.51 R5.1
N$25
  Bottom 0.813: 114.3,7.62 114.3,35.56 113.03,36.83 113.03,44.45 111.76,45.72 107.95,45.72 JP10.1
  Bottom 1.676: Q1.3 114.3,7.62 R12.1
N$26
  Bottom 0.813: U$4.2 7.62,71.12 5.08,68.58 5.08,58.42 6.91,58.42 S1.3
N$27
  Bottom 0.66: R4.1 69.85,54.61 R2.2 60.96,54.61 IC1.1 IC1.3
N$28
  Bottom 0.813: JP25.2 62.86,62.23 70.48,62.23 70.48,65.41 69.53,66.36 69.53,66.61
  Bottom 1.27: U$2.AREF 69.53,66.61
N$29
  Bottom 0.66: IC2.5 78.74,44.45 78.74,40.96 80.8,39.05 R14.1
  Bottom 0.813: R14.1 83.82,39.05 C2.+
N$30
  Bottom 0.813: S2.3 21.67,59.61 10.16,71.12 U$4.3
N$31
  Bottom 0.813: S3.3 5.08,40.64 5.08,53.34 25.4,53.34 25.4,58.42 12.7,71.12 U$4.4
N$32
  Bottom 0.813: JP12.1 83.82,29.21 | 83.82,29.21 87.63,29.21 88.9,27.94 90.17,27.94 R21.2 | R39.2 81.28,29.21 83.82,29.21
N$33
  Bottom 0.813: JP10.2 99.06,40.64 97.79,39.37 95.88,39.37 94.77,40.48 93.03,40.48 R14.2
N$34
  Bottom 0.813: IC2.8 64.77,49.53 JP21.1 64.77,48.26 63.5,49.53 R34.1
N$35
  Bottom 0.813: JP11.2 R20.1
N$36
  Bottom 0.813: IC2.13 R37.1 R36.1
N$37
  Bottom 0.813: U$4.6 17.78,76.2 34.29,59.69 34.29,45.72 29.21,40.64 29.21,35.56 5.08,35.56 5.08,25.96 S4.3
N$38
  Bottom 0.813: S5.3 29.13,24.05 35.56,30.48 35.56,60.33 20.32,75.56 | 19.68,77.47 U$4.7
  Bottom 1: 20.32,75.56 U$4.7
N$39
  Bottom 0.813: R8.2 44.61,68.58 44.61,12.86 45.09,11.43 45.09,6.99 35.56,6.99 LED5.A
N$40
  Bottom 0.813: R9.2 42.55,63.5 43.18,63.5 LED6.A
N$41
  Bottom 0.813: R5.2 29.21,13.97 39.37,13.97 39.37,73.66 38.1,74.93 U$6.3
N$42
  Bottom 0.813: R9.1 27.94,73.03
  Bottom 1: 27.94,73.03 U$6.7
N$43
  Bottom 0.813: JP19.2 66.04,44.45 IC2.10
N$44
  Bottom 0.813: R32.1 59.69,44.45 JP19.1
N$45
  Bottom 0.813: IC2.12 R38.2 62.23,38.1 60.96,38.1 58.42,40.64 58.42,41.28 52.7,41.28 R35.1
N$46
  Bottom 0.813: R35.2 52.7,26.67 JP22.2 JP22.1
N$47
  Bottom 0.813: JP23.2 JP23.1 R36.2
N$48
  Top 0.813: JP24.1 R38.1
  Bottom 0.813: R38.1 62.23,34.29 62.23,32.39 68.58,32.39 IC2.14 | JP24.2 JP24.1
N$49
  Bottom 0.813: IC2.9 69.85,46.99 70.96,48.26 70.96,50.8 69.85,52.07 64.13,52.07 R34.2 62.86,52.07 60.96,52.07 R33.1
N$50
  Bottom 1.676: C6.2 R25.2
N$51  (via drill 1)
  Top 0.813: v106.05,65.41 v123.19,65.41
  Bottom 0.813: R23.2 123.19,62.23 | v123.19,65.41 123.19,62.23 | 123.19,62.23 Q4.G | R22.2 92.71,64.77 106.05,64.77 v106.05,65.41
N$52
  Bottom 1.27: JP7.1 U$2.D0
N$53
  Bottom 0.813: U$2.RESET JP4.1
N$54  (via drill 1)
  Top 0.813: v114.3,74.93 v121.92,74.93
  Bottom 0.813: JP14.2 99.06,62.23 107.95,62.23 114.3,68.58 v114.3,74.93 | v121.92,74.93 123.23,77.51 123.23,86.36 | 123.23,86.36 X3.4 | JP16.1 123.23,86.36
N$55  (via drill 0.8 pad 6.45)
  other vias: 144.62,55.88
N$56  (via drill 0.8 pad 6.45)
  other vias: 152.08,38.1
N$57
  Bottom 0.406: 82.55,90.81 85.72,90.81
  Bottom 0.813: DIS1.3 82.55,90.81 | 85.72,90.81 86.36,91.44 86.36,93.98 101.6,93.98 R41.S
N$58  (via drill 0.8 pad 6.45)
  other vias: 152.08,10.16
N$59  (via drill 0.8 pad 2.54)
  other vias: 123.83,45.72
N$60  (via drill 0.8 pad 2.54)
  other vias: 136.53,45.72
N$61  (via drill 0.8 pad 2.54)
  other vias: 118.11,39.37
N$62  (via drill 0.8 pad 2.54)
  other vias: 128.27,39.37
N$63
  Bottom 0.813: JP26.2 86.36,85.09 83.82,87.63 81.28,87.63 DIS1.4
N$64
  Bottom 0.813: R2.1 64.77,64.77 64.13,65.41 JP25.1
N$67
  Bottom 0.66: 77.47,68.58 U$2.D12
  Bottom 0.813: 77.22,71.75 83.82,71.75 U$3.5 JP26.1
  Bottom 1.27: 77.22,71.75 U$2.D12
N$68
  Bottom 0.813: R6.1 26.67,7.62 26.67,15.24 38.1,15.24 38.1,72.39 36.83,73.66 35.56,73.66 U$6.4
N$69  (via drill 1)
  Top 0.813: v61.12,67.94 v61.12,73.18
  Bottom 0.406: 72.39,86.36 72.39,90.78
  Bottom 0.66: U$5.7 v71.12,82.55 71.12,85.09 72.39,86.36 | 72.39,90.78 DIS1.11
  Bottom 0.813: v61.12,73.18 71.12,73.18 U$5.7 | 62.86,68.58 v61.12,67.94
  Bottom 1.27: U$2.SCL 62.86,68.58
N$70
  Bottom 0.813: U$6.2 40.64,19.69 R3.2
N$71  (via drill 1)
  Top 0.813: v78.74,74.3 67.31,73.66 67.31,67.31 v66.99,66.36
  Bottom 0.813: v78.74,74.3 U$3.7 v78.74,82.55 DIS1.6 | v66.99,66.36 67.06,67.06
  Bottom 1.27: 67.06,67.06 U$2.SDA
N$73
  Bottom 0.813: S6.3 24.13,41.91 24.13,48.26 26.67,50.8 26.67,59.05 15.24,70.48 U$4.5
N$74
  Bottom 0.813: U$3.4 86.36,73.66 86.11,73.66 86.42,70.17
  Bottom 1.27: 86.42,70.17 U$2.D8
N$75
  Bottom 0.813: U$3.3 88.9,76.2 87.63,74.93 87.63,71.12 90.17,68.58
  Bottom 1.27: 90.17,68.58 U$2.D7
N$76
  Bottom 0.813: U$3.2 92.71,73.66 99.06,73.66
  Bottom 1.27: 99.06,73.66 U$2.D4
N$77  (via drill 1)
  Top 0.813: v90.17,73.66 v81.28,73.66
  Bottom 0.406: 80.01,86.36 80.01,90.78
  Bottom 0.66: 80.01,90.78 DIS1.5
  Bottom 0.813: U$2.D6 v90.17,73.66 | v81.28,73.66 U$3.6 v81.28,82.55 81.28,85.09 80.01,86.36
N$78  (via drill 1)
  Bottom 0.66: 66.04,81.92 58.42,81.92 54.61,81.92 52.07,79.38 52.07,73.66 50.8,73.66 50.8,69.85 52.07,69.85 52.07,59.69 57.15,59.69 57.15,58.42 77.47,58.42 77.47,59.69 82.55,59.69 84.93,62.23 84.77,62.55
  Bottom 0.813: 66.04,81.92 U$5.5 | DIS1.13 68.58,93.98 58.42,93.98 v58.42,85.09 58.42,81.92
  Bottom 1.27: 84.77,62.55 U$2.D9
N$84
  Bottom 0.813: U$6.6 30.48,73.03 R8.1
PWM_CHARGE1
  Bottom 0.813: R10.1 111.76,83.82 101.6,83.82 97.79,83.82 97.79,77.47 101.6,77.47
  Bottom 1.27: 101.6,77.47 U$2.D3
PWM_CHARGE2
  Bottom 0.813: U$2.D11 80.01,68.33
  Bottom 1.27: 80.01,68.33 R22.1
PWM_DISCHARGE1  (via drill 1)
  Top 0.813: v63.5,80.01 v63.5,83.82
  Bottom 0.66: 82.55,68.58 U$2.D10 | U$5.4 v63.5,80.01 54.61,80.01 53.34,78.74 53.34,60.8 58.42,60.8 58.42,59.69 76.2,59.69 76.2,60.96 80.64,60.8 81.28,61.59 R11.1 | v63.5,83.82 v66.04,83.82 67.31,85.09 67.31,87 68.58,88.27 DIS1.14
  Bottom 1.27: R11.1 81.91,67.31 82.55,68.58
PWM_DISCHARGE2  (via drill 1)
  Top 0.813: v68.58,80.65 v100.33,80.65
  Bottom 0.66: v68.58,80.65 v68.58,82.55 68.58,84.45 71.12,87 DIS1.12
  Bottom 0.813: U$5.6 v68.58,80.65 | v100.33,80.65 106.68,80.65 JP7.2
  Bottom 1.27: JP7.2 U$2.D1
U_BATT1
  Bottom 1.27: U$2.A0 JP18.2
U_BATT2
  Bottom 1.27: U$2.A3 JP5.1
VCC  (via drill 0.8)
  Top 0.813: v68.58,15.24 v84.45,15.24
  Bottom 0.66: 94.62,10.8 101.6,5.08 146.05,5.08 146.05,24.13
  Bottom 0.813: JP8.1 63.5,21.59 64.77,21.59 68.58,21.59 v68.58,15.24 68.58,13.34 71.12,13.34 72.39,12.7 72.39,10.16 JP20.2 | v84.45,15.24 84.45,10.8 94.62,10.8 | 151.13,91.48 X2.1
  Bottom 1.27: JP9.1 64.77,16.51 64.77,21.59
  Bottom 1.676: 154.94,65.41 R16.2 151.13,69.85 X2.1 | 154.94,65.41 154.94,43.18 146.05,43.18 146.05,24.13 135.89,24.13 134.62,25.4 Q3.3 | C5.+ 154.94,65.41
VIN  (via drill 1.3)
  Top 1.27: v66.67,17.14 v88.9,17.14
  Bottom 1.27: X1.1 63.5,6.35 63.5,11.43 | 63.5,11.43 66.67,11.43 v66.67,17.14 | v88.9,17.14 91.44,17.14 U$2.VIN | 63.5,11.43 60.96,11.43 JP9.2 58.42,13.97 JP1.3 JP1.2 JP1.1

### Text on the board
Bottom: v1 | ChgShieldExpA | v1